# Altium schematic sheet 12864.SchDoc
size A4
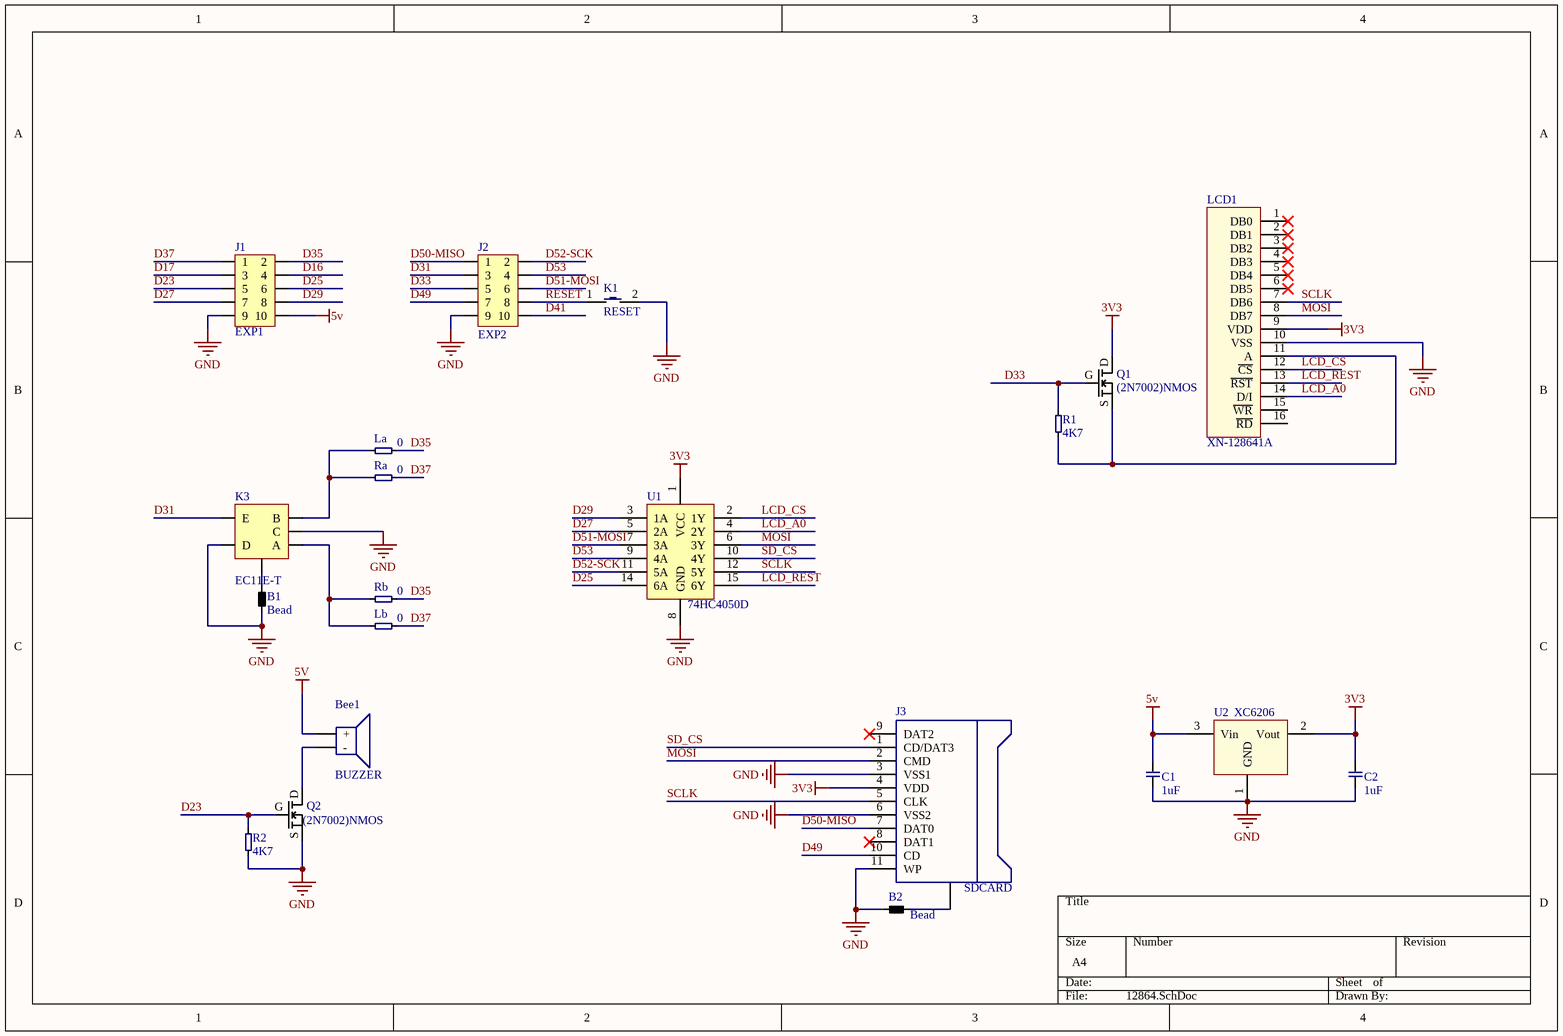
[diagram p0: 12864.SchDoc]

## Parts
B1  Bead  [Bead0805(2012)]
B2  Bead  [Bead0805(2012)]
Bee1  BUZZER  [BUZZER-9*5.5]
C1  1uF  [C0805(2012)]
C2  1uF  [C0805(2012)]
J1  EXP1  [DC3-10P-2.54]
J2  EXP2  [DC3-10P-2.54]
J3  SDCARD  [SDCARD-SD-006(www.sofng.com)]
K1  RESET  [KEY-6x6-T]
K3  EC11E-T  [EC11E-T]
La  0  [R0603(1608)]
Lb  0  [R0603(1608)]
LCD1  XN-128641A  [XN-128641A]
Q1  (2N7002)NMOS  [NMOS-SOT-23]
Q2  (2N7002)NMOS  [NMOS-SOT-23]
R1  4K7  [R0805(2012)]
R2  4K7  [R0805(2012)]
Ra  0  [R0603(1608)]
Rb  0  [R0603(1608)]
U1  74HC4050D  [74HC4050D-SO16]
U2  XC6206  [XC6206P332MR]

## Nets
3V3: C2.2 J3.4(VDD) LCD1.9(VDD) Q1.D U1.1(VCC) U2.2(Vout)
5V: Bee1.1(+) C1.2 J1.10 U2.3(Vin)
GND: B1.1 B2.1 C1.1 C2.1 J1.9 J2.9 J3.3(VSS1) J3.6(VSS2) J3.11(WP) K1.2 K3.C K3.D LCD1.10(VSS) Q2.S R2.1 U1.8(GND) U2.1(GND)
D16: J1.4
D17: J1.3
D23: J1.5 Q2.G R2.2
D25: J1.6 U1.14(6A)
D27: J1.7 U1.5(2A)
D29: J1.8 U1.3(1A)
D31: J2.3 K3.E
D33: J2.5 Q1.G R1.2
D35: J1.2 La.1 Rb.1
D37: J1.1 Lb.1 Ra.1
D41: J2.10
D49: J2.7 J3.10(CD)
D50-MISO: J2.1 J3.7(DAT0)
D51-MOSI: J2.6 U1.7(3A)
D52-SCK: J2.2 U1.11(5A)
D53: J2.4 U1.9(4A)
LCD_A0: LCD1.14(D/I) U1.4(2Y)
LCD_CS: LCD1.12(~{CS}) U1.2(1Y)
LCD_REST: LCD1.13(~{RST}) U1.15(6Y)
MOSI: J3.2(CMD) LCD1.8(DB7) U1.6(3Y)
RESET: J2.8 K1.1
SCLK: J3.5(CLK) LCD1.7(DB6) U1.12(5Y)
SD_CS: J3.1(CD/DAT3) U1.10(4Y)
NetB1_2: B1.2 K3.0
NetB2_2: B2.2 J3.0
NetBee1_2: Bee1.2(-) Q2.D
NetK3_A: K3.A Lb.2 Rb.2
NetK3_B: K3.B La.2 Ra.2
NetLCD1_11: LCD1.11(A) Q1.S R1.1

Not connected (* = marked no-connect by the designer): J3 8(DAT1)* 9(DAT2)*; LCD1 1(DB0)* 2(DB1)* 3(DB2)* 4(DB3)* 5(DB4)* 6(DB5)* 15(~{WR}) 16(~{RD})

## Library data of the parts
C1 C2 = Caps
J1 J2 = H5Px2
K1 = KEY
La Lb R1 R2 Ra Rb = Ress
LCD1 = XN-12864
Q1 Q2 = NMOS